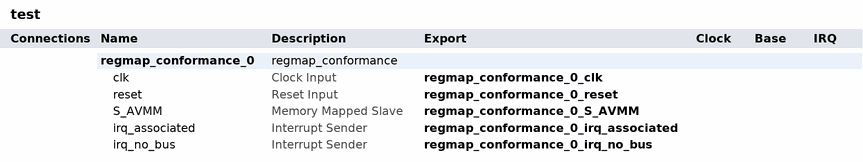
[diagram p0: system contents]
# Platform Designer (Qsys) system test
# Parameters at their usual value, and those the tool derives, are not listed.
package require qsys
create_system test

add_instance regmap_conformance_0 regmap_conformance 1.0.0

# exported interfaces
add_interface regmap_conformance_0_clk clock sink
set_interface_property regmap_conformance_0_clk EXPORT_OF regmap_conformance_0.clk
add_interface regmap_conformance_0_reset reset sink
set_interface_property regmap_conformance_0_reset EXPORT_OF regmap_conformance_0.reset
add_interface regmap_conformance_0_S_AVMM avalon slave
set_interface_property regmap_conformance_0_S_AVMM EXPORT_OF regmap_conformance_0.S_AVMM
add_interface regmap_conformance_0_irq_associated interrupt sender
set_interface_property regmap_conformance_0_irq_associated EXPORT_OF regmap_conformance_0.irq_associated
add_interface regmap_conformance_0_irq_no_bus interrupt sender
set_interface_property regmap_conformance_0_irq_no_bus EXPORT_OF regmap_conformance_0.irq_no_bus

save_system test.qsys
